# EAGLE design SquareWaveGenerator (EAGLE 5.10)
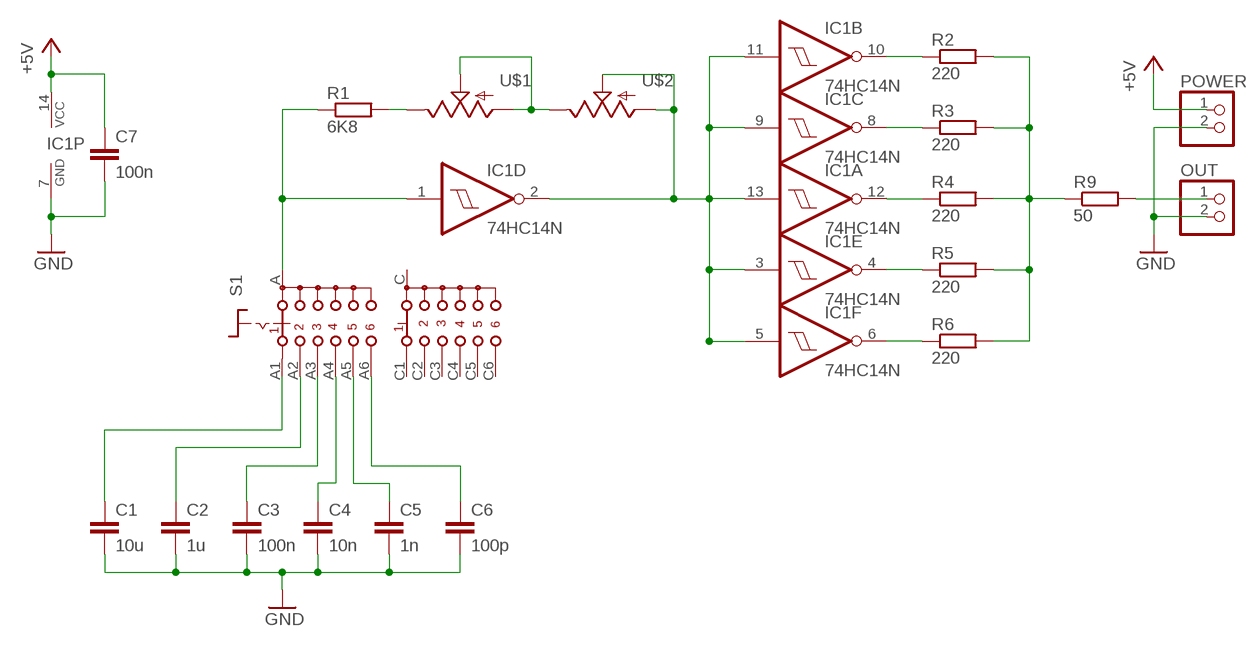
[diagram p0: schematic, sheet 1]

## Parts
C1  10u  C-EU050-030X075  [C050-030X075]
C2  1u  C-EU050-030X075  [C050-030X075]
C3  100n  C-EU050-030X075  [C050-030X075]
C4  10n  C-EU050-030X075  [C050-030X075]
C5  1n  C-EU050-030X075  [C050-030X075]
C6  100p  C-EU050-030X075  [C050-030X075]
C7  100n  C-EU050-030X075  [C050-030X075]
IC1  74HC14N  [DIL14]
OUT  PINHD-1X2  [1X02]
POWER  PINHD-1X2  [1X02]
R1  6K8  R-EU_0204/7  [0204/7]
R2  220  R-EU_0204/7  [0204/7]
R3  220  R-EU_0204/7  [0204/7]
R4  220  R-EU_0204/7  [0204/7]
R5  220  R-EU_0204/7  [0204/7]
R6  220  R-EU_0204/7  [0204/7]
R9  50  R-EU_0204/7  [0204/7]
S1  CK102X06  [CK102X06]
U$1  POTMAM  [POT_MAMMOTH]
U$2  POTMAM  [POT_MAMMOTH]

## Nets
+5V: C7.1 IC1.14(P:VCC) POWER.1
GND: C1.2 C2.2 C3.2 C4.2 C5.2 C6.2 C7.2 IC1.7(P:GND) OUT.2 POWER.2
N$1: IC1.6(F:O) R6.1
N$2: IC1.4(E:O) R5.1
N$3: IC1.2(D:O) IC1.3(E:I) IC1.5(F:I) IC1.9(C:I) IC1.11(B:I) IC1.13(A:I) U$2.P$1(S) U$2.P$2(A)
N$4: IC1.8(C:O) R3.1
N$5: IC1.10(B:O) R2.1
N$7: U$1.P$1(S) U$1.P$2(A) U$2.P$3(E)
N$8: R2.2 R3.2 R4.2 R5.2 R6.2 R9.1
N$9: R1.2 U$1.P$3(E)
N$10: IC1.1(D:I) R1.1 S1.A
N$11: C1.1 S1.A1
N$12: C2.1 S1.A2
N$13: C3.1 S1.A3
N$14: C4.1 S1.A4
N$15: C5.1 S1.A5
N$16: C6.1 S1.A6
N$17: OUT.1 R9.2
N$18: IC1.12(A:O) R4.1
Unconnected: S1.C S1.C1 S1.C2 S1.C3 S1.C4 S1.C5 S1.C6

## Library data of the parts
C1-C7 = resistor:C-EU: CAPACITOR, European symbol
IC1 = 74xx-eu:74*14: Hex schmitt trigger INVERTER
OUT POWER = pinhead:PINHD-1X2: PIN HEADER
R1-R6 R9 = resistor:R-EU_: RESISTOR, European symbol
S1 = switch:CK102X06: ROTARY SWITCH C&K
U$1 U$2 = SparkFun:POT

## Net classes
0 default: width 0.635 mm, drill 0.635 mm, clearance 0.635 mm

## Board
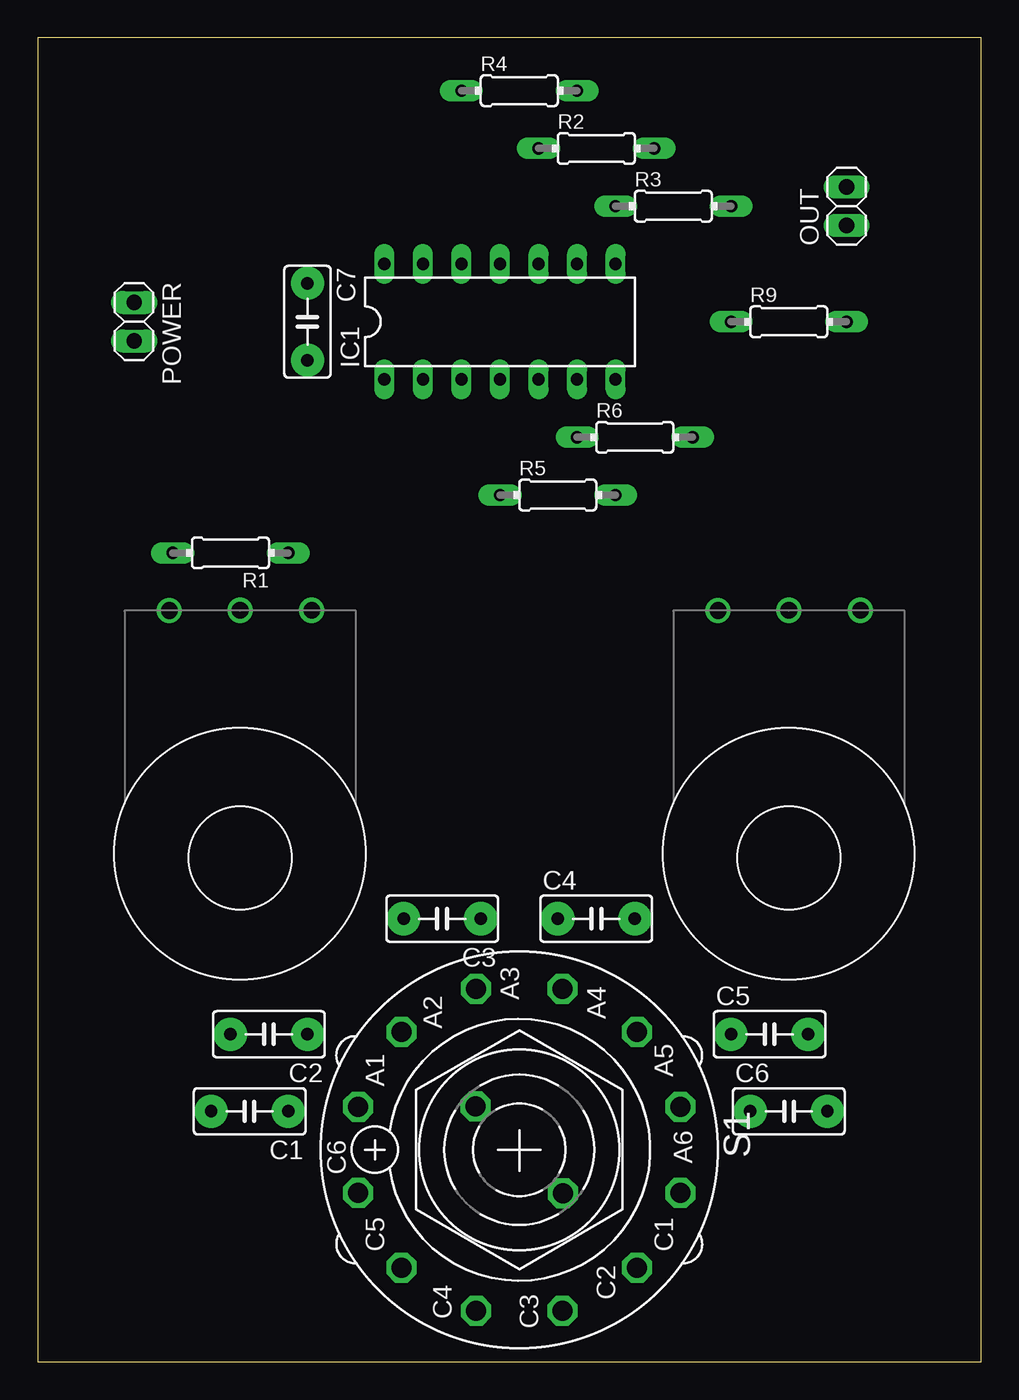
[diagram p1: board, top side]
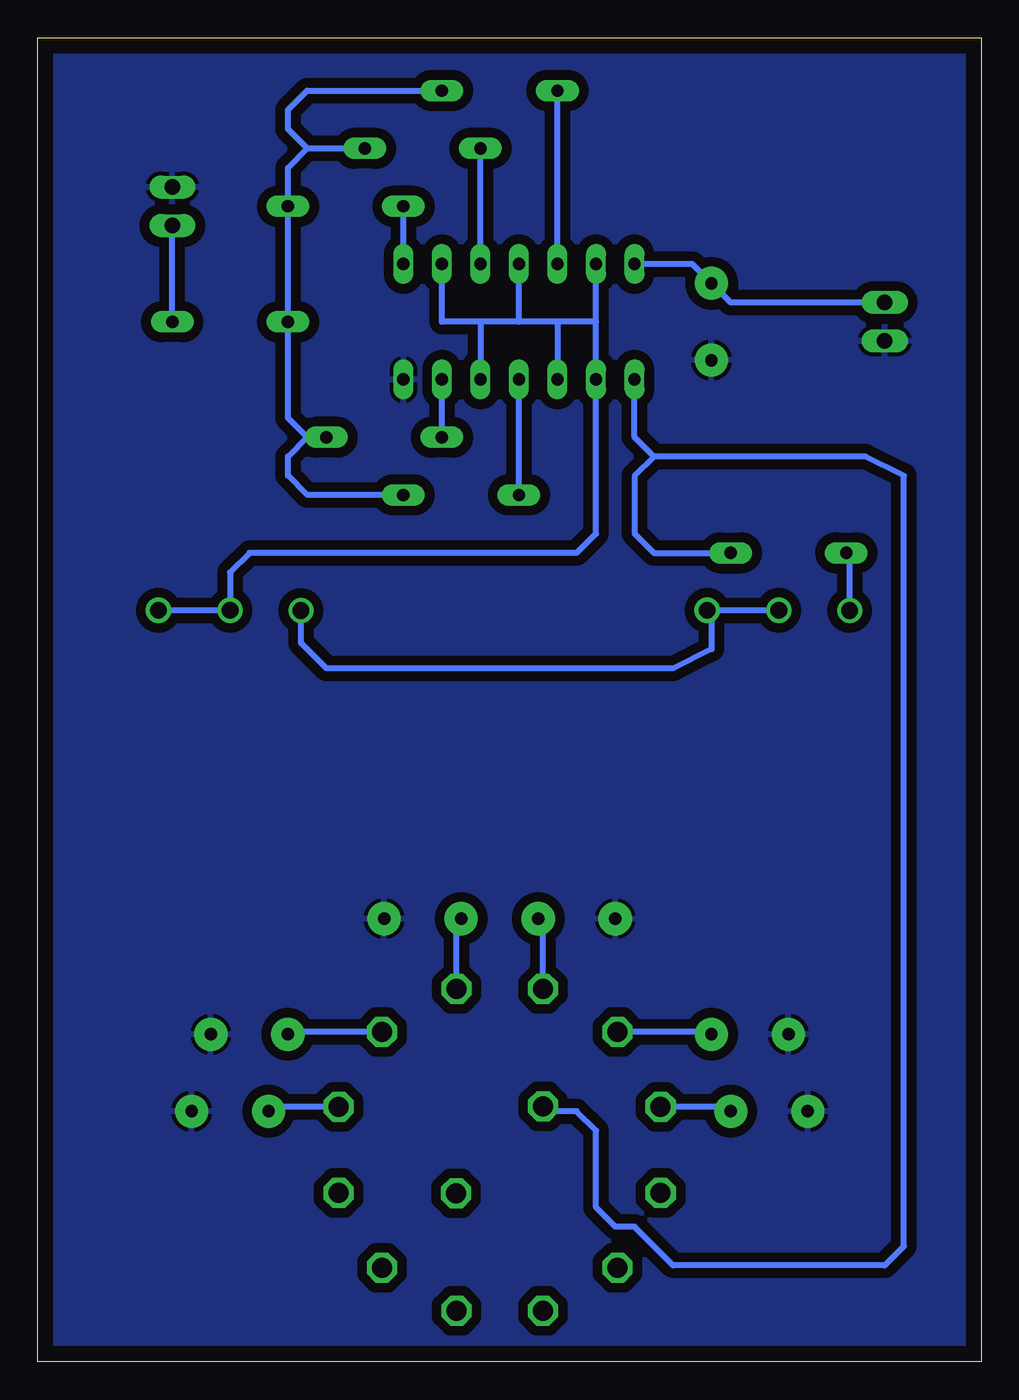
[diagram p2: board, bottom side, seen from below]

Size 62.21 x 87.3 mm. Coordinates in mm from the lower left corner, seen from the top.
Outline: 0,0 62.21,0 62.21,87.3 0,87.3 0,0
Copper layers (1*16): Top 0.035mm / dielectric 1.5mm / Bottom 0.035mm
Design rules "default": minimum track width 10mil, minimum drill 24mil, track to track 8mil, track to pad 8mil, pad to pad 8mil, via to via 8mil, smd to smd 8mil, copper to edge 40mil, drill to drill 8mil, minimum pad ring 10mil, minimum via ring 8mil, stop-mask expansion 4mil, vias tented up to drill 0mil, thermal gap 10mil

### Footprints (pad centres in the part's own frame; a part is rotated, then mirrored left to right if it is on the bottom)
C050-030X075 = drill 0.813 pad 2.184 round: 1 -2.54,0; 2 2.54,0
DIL14 = drill 0.813 long: 1 -7.62,-3.81; 2 -5.08,-3.81; 3 -2.54,-3.81; 4 0,-3.81; 5 2.54,-3.81; 6 5.08,-3.81; 7 7.62,-3.81; 8 7.62,3.81; 9 5.08,3.81; 10 2.54,3.81; 11 0,3.81; 12 -2.54,3.81; 13 -5.08,3.81; 14 -7.62,3.81
1X02 = drill 1.016 long: 1 -1.27,0; 2 1.27,0
0204/7 = drill 0.813 pad 1.422 long: 1 -3.81,0; 2 3.81,0
CK102X06 = drill 1.321 octagon: A -2.87,-2.87; A1 -2.845,-10.617; A2 -7.772,-7.772; A3 -10.617,-2.845; A4 -10.617,2.845; A5 -7.772,7.772; A6 -2.845,10.617; C 2.87,2.87; C1 2.845,10.617; C2 7.772,7.772; C3 10.617,2.845; C4 10.617,-2.845; C5 7.772,-7.772; C6 2.845,-10.617
POT_MAMMOTH = drill 1.1 round: P$1 -4.73,-0.02; P$2 0,-0.02; P$3 4.67,-0.01

### Placement (x,y rotation side)
C1  13.97,16.51 180 top
C2  15.24,21.59 180 top
C3  26.67,29.21 180 top
C4  36.83,29.21 0 top
C5  48.26,21.59 0 top
C6  49.53,16.51 0 top
C7  17.78,68.58 270 top
IC1  30.48,68.58 0 top
OUT  53.34,76.2 90 top
POWER  6.35,68.58 270 top
R1  12.7,53.34 180 top
R2  36.83,80.01 0 top
R3  41.91,76.2 0 top
R4  31.75,83.82 0 top
R5  34.29,57.15 0 top
R6  39.37,60.96 0 top
R9  49.53,68.58 0 top
S1  31.75,13.97 270 top
U$1  13.34,49.53 180 top
U$2  49.53,49.53 180 top

### Tracks (layer width: path | path; a pad name or v marks a point on that pad's centre or on a via)
+5V
  Bottom 0.406: POWER.1 16.51,69.85 C7.1 19.05,72.39 IC1.14
GND
  pour Bottom: -1.27,88.9 63.5,88.9 63.5,-1.27 -1.27,-1.27
N$1
  Bottom 0.406: R6.1 IC1.6
N$2
  Bottom 0.406: R5.1 IC1.4
N$3
  Bottom 0.406: U$2.P$1 U$2.P$2 49.53,52.07 48.26,53.34 26.67,53.34 25.4,54.61 IC1.2 25.4,68.58 | 25.4,68.58 27.94,68.58 | 27.94,68.58 30.48,68.58 | 30.48,68.58 33.02,68.58 | 33.02,68.58 35.56,68.58 IC1.9 | 33.02,68.58 IC1.5 | 30.48,68.58 IC1.11 | 25.4,68.58 IC1.13 | 27.94,68.58 IC1.3
N$4
  Bottom 0.406: IC1.8 R3.1
N$5
  Bottom 0.406: IC1.10 R2.1
N$7
  Bottom 0.406: U$1.P$2 U$1.P$1 17.78,49.27 17.78,46.99 20.32,45.72 43.18,45.72 44.86,47.4 U$2.P$3
N$8
  Bottom 0.406: R4.2 44.45,83.82 45.72,82.55 45.72,81.28 44.45,80.01 | 44.45,80.01 R2.2 | 44.45,80.01 45.72,78.74 R3.2 R9.1 45.72,62.23 44.45,60.96 | 44.45,60.96 R6.2 | 44.45,60.96 45.72,59.69 45.72,58.42 44.45,57.15 R5.2
N$9
  Bottom 0.406: U$1.P$3 8.66,53.12 R1.2
N$10
  Bottom 0.406: R1.1 21.59,53.34 22.86,54.61 22.86,58.42 21.59,59.69 | 21.59,59.69 7.62,59.69 5.08,58.42 5.08,7.62 6.35,6.35 20.32,6.35 22.86,8.89 24.13,8.89 25.4,10.16 25.4,15.24 26.67,16.51 28.55,16.51 S1.A | 21.59,59.69 22.86,60.96 IC1.1
N$11
  Bottom 0.406: S1.A1 16.82,16.82 C1.1
N$12
  Bottom 0.406: S1.A2 17.93,21.74 C2.1
N$13
  Bottom 0.406: S1.A3 28.91,28.91 C3.1
N$14
  Bottom 0.406: S1.A4 34.59,28.91 C4.1
N$15
  Bottom 0.406: S1.A5 45.57,21.74 C5.1
N$16
  Bottom 0.406: S1.A6 46.69,16.82 C6.1
N$17
  Bottom 0.406: R9.2 OUT.1
N$18
  Bottom 0.406: IC1.12 R4.1